# Altium project BLE-Control.PrjPcb
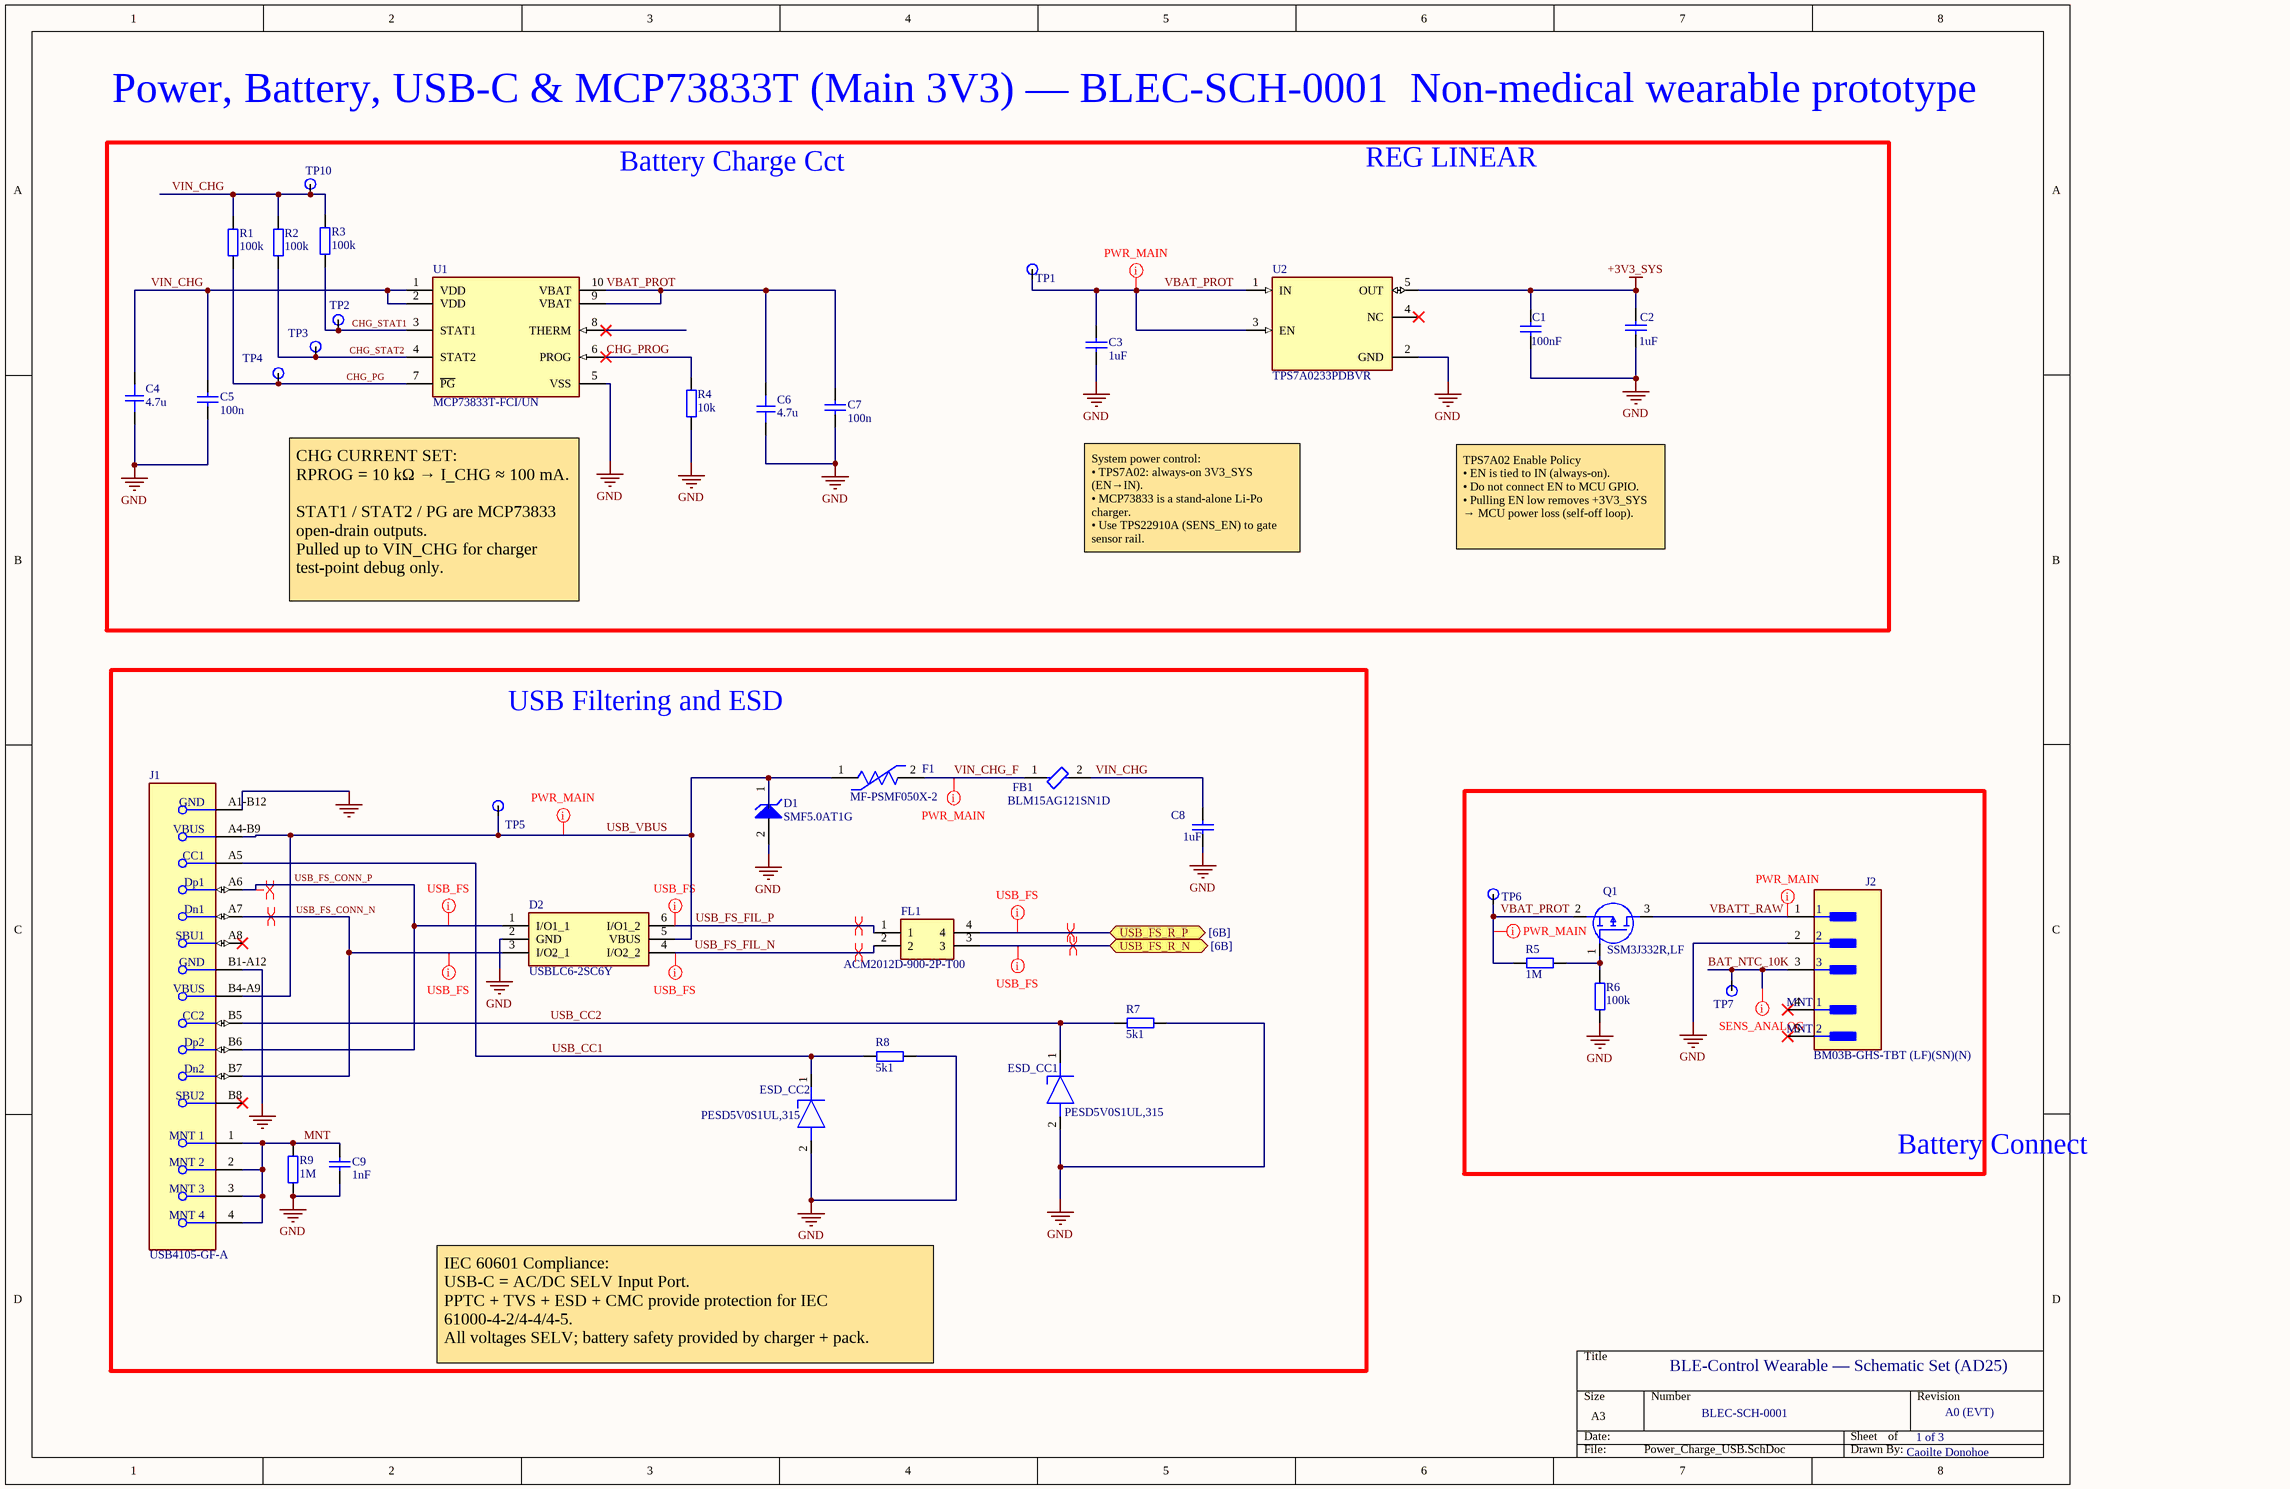
[diagram p0: Power_Charge_USB.SchDoc]
3 sheets, 107 parts. Net scope: flat (ports and power ports of the same name join across sheets).
Board file: BLE-Control.PcbDoc
Sheets:
  Power_Charge_USB.SchDoc
  MCU_RF.SchDoc
  Sensor_IO_Buttons_LED.SchDoc

## Sheet Power_Charge_USB.SchDoc
size A3; SheetNumber: 1; SheetTotal: 3

### Parts
C1  100nF  [CAP_0402]
C2  1uF  [CAP_0402]
C3  1uF  [CAP_0402]
C4  4.7u  [CAP_0603]
C5  100n  [CAP_0402]
C6  4.7u  [CAP_0603]
C7  100n  [CAP_0402]
C8  1uF  [CAP_0402]
C9  1nF  [CAP_0402]
D1  SMF5.0AT1G  [ONSC-SOD-123FL-2-498_V]
D2  USBLC6-2SC6Y  [SOT95P280X145-6N]
ESD_CC1  PESD5V0S1UL,315  [PESD5V0S1BL315]
ESD_CC2  PESD5V0S1UL,315  [PESD5V0S1BL315]
F1  MF-PSMF050X-2  [FP-MF-PSMF-MFG]
FB1  BLM15AG121SN1D  [FP-BLM15-0_05-IPC_A]
FL1  ACM2012D-900-2P-T00  [ACM2012D9002PT00]
J1  USB4105-GF-A  [FP-USB4105-GF-A-MFG]
J2  BM03B-GHS-TBT (LF)(SN)(N)  [FP-BM03B-GHS-TBT_LF_SN-MFG]
Q1  SSM3J332R,LF  [SSM3J332RLFT]
R1  100k  [RES_0603]
R2  100k  [RES_0603]
R3  100k  [RES_0603]
R4  10k  [RES_0402]
R5  1M  [RES_0402]
R6  100k  [RES_0402]
R7  5k1  [RES_0402]
R8  5k1  [RES_0402]
R9  1M  [RES_0402]
TP1  TestPoint  [PCBComponent_1]  (value not drawn)
TP2  USB_VBUS  [PCBComponent_1]  (value not drawn)
TP3  USB_VBUS  [PCBComponent_1]  (value not drawn)
TP4  USB_VBUS  [PCBComponent_1]  (value not drawn)
TP5  USB_VBUS  [PCBComponent_1]  (value not drawn)
TP6  VBAT_PROT  [PCBComponent_1]  (value not drawn)
TP7  BAT_NTC_10K  [PCBComponent_1]  (value not drawn)
TP10  (no value)  [TP_VIA_0p75]
U1  MCP73833T-FCI/UN  [FP-C04-021-IPC_B]
U2  TPS7A0233PDBVR  [FP-DBV0005A-IPC_A]

### Blocks framed on the sheet
USB Filtering and ESD: C8 C9 D1 D2 ESD_CC1 ESD_CC2 F1 FB1 FL1 J1 R7-R9 TP5
Battery Connect: J2 Q1 R5 R6 TP6 TP7

### Ports
USB_FS_R_N (bidir, see [6B]), USB_FS_R_P (bidir, see [6B])

### Nets
+3V3_SYS: C1.2 C2.2 U2.5(OUT)
GND: C1.1 C2.1 C3.1 C4.1 C5.1 C6.1 C7.1 C8.1 C9.1 D1.2(A) D2.2(GND) ESD_CC1.2(A) ESD_CC2.2(A) J1.A1-B12(GND) J1.B1-A12(GND) J2.2 R4.1 R6.1 R7.2 R8.2 R9.1 U1.5(VSS) U2.2(GND)
BAT_NTC_10K: J2.3 TP7.1
CHG_PG: R1.1 TP4.1 U1.7(~{PG})
CHG_PROG: R4.2 U1.6(PROG)
CHG_STAT1: R3.1 TP2.1 U1.3(STAT1)
CHG_STAT2: R2.1 TP3.1 U1.4(STAT2)
MNT: C9.2 J1.1(MNT_1) J1.2(MNT_2) J1.3(MNT_3) J1.4(MNT_4) R9.2
USB_CC1: ESD_CC2.1(K) J1.A5(CC1) R8.1
USB_CC2: ESD_CC1.1(K) J1.B5(CC2) R7.1
USB_FS_CONN_N: D2.3(I/O2_1) J1.A7(Dn1) J1.B7(Dn2)
USB_FS_CONN_P: D2.1(I/O1_1) J1.A6(Dp1) J1.B6(Dp2)
USB_FS_FIL_N: D2.4(I/O2_2) FL1.2
USB_FS_FIL_P: D2.6(I/O1_2) FL1.1
USB_FS_R_N: FL1.3 ; port USB_FS_R_N
USB_FS_R_P: FL1.4 ; port USB_FS_R_P
USB_VBUS: D1.1(K) D2.5(VBUS) F1.1 J1.A4-B9(VBUS) J1.B4-A9(VBUS) TP5.1
VBAT_PROT: C3.2 C6.2 C7.2 Q1.2(S) R5.1 TP1.1 TP6.1 U1.9(VBAT) U1.10(VBAT) U2.1(IN) U2.3(EN)
VBATT_RAW: J2.1 Q1.3(D)
VIN_CHG: C4.2 C5.2 C8.2 FB1.2 R1.2 R2.2 R3.2 TP10.1 U1.1(VDD) U1.2(VDD)
VIN_CHG_F: F1.2 FB1.1
NetQ1_1: Q1.1(G) R5.2 R6.2

Not connected (* = marked no-connect by the designer): J1 A8(SBU1)* B8(SBU2)*; J2 4(MNT_1)* 5(MNT_2)*; U1 8(THERM)*; U2 4(NC)*

### Layout directives
differential pair; differential pair class USB: USB_FS_CONN_N, USB_FS_CONN_P, USB_FS_FIL_N, USB_FS_FIL_P, USB_FS_R_N, USB_FS_R_P
net class USB_FS: USB_FS_CONN_N, USB_FS_CONN_P, USB_FS_FIL_N, USB_FS_FIL_P, USB_FS_R_N, USB_FS_R_P
net class PWR_MAIN: USB_VBUS, VBAT_PROT, VBATT_RAW, VIN_CHG_F
net class SENS_ANALOG: BAT_NTC_10K

### Notes on the sheet
- Power, Battery, USB-C & MCP73833T (Main 3V3) — BLEC-SCH-0001  Non-medical wearable prototype
- Battery Charge Cct
- REG LINEAR
- System power control:
  • TPS7A02: always-on 3V3_SYS (EN→IN).
  • MCP73833 is a stand-alone Li-Po charger.
  • Use TPS22910A (SENS_EN) to gate sensor rail.
- TPS7A02 Enable Policy
  • EN is tied to IN (always-on).
  • Do not connect EN to MCU GPIO.
  • Pulling EN low removes +3V3_SYS → MCU power loss (self-off loop).
- CHG CURRENT SET:
  RPROG = 10 kΩ → I_CHG ≈ 100 mA.
  STAT1 / STAT2 / PG are MCP73833 open-drain outputs.
  Pulled up to VIN_CHG for charger test-point debug only.
- IEC 60601 Compliance:
  USB-C = AC/DC SELV Input Port.
  PPTC + TVS + ESD + CMC provide protection for IEC 61000-4-2/4-4/4-5.
  All voltages SELV; battery safety provided by charger + pack.
- BLE-Control Wearable — Schematic Set (AD25)
- BLEC-SCH-0001
- 1 of 3
- A0 (EVT)
- Caoilte Donohoe

### Library data of the parts
C1-C3 C5 C7 = C_0402: Ceramic Chip Capacitor 0402; Voltage: 10V; Dielectric: X7R; Tolerance: 10%; ProductionStatus: Placeholder; Package: 0402 (1005); Height: 0.35mm
C4 C6 = CAP_0603: Capacitor SMD 0603; Manufacturer: *; Manufacturer Part Number: *; Distributor Link: *; LCSC: *; Rating: *; Dielectric: *
C8 C9 = C_0402: Ceramic Chip Capacitor 0402; PartNumber: C1005X5R1E105K; Voltage: 10V; Dielectric: X7R; Tolerance: 10%; ProductionStatus: Placeholder; Package: 0402 (1005); Height: 0.35mm; Part Number: C1005X5R1E105K
D1 = CMP-1061-00612-1: 200 W Transient Voltage Suppressor, 2-Pin SOD-123FL, Pb-Free, Tape and Reel; Manufacturer: On Semiconductor; Direction: Unidirectional; IR Max (uA): 400; V(BR) Typ (V): 6.7; PackageDescription: 2-Pin SOD, Body 1.65 x 2.7 mm; PartNumber: SMF5.0AT1G; ComponentLink3Description: Package Specification; ComponentLink3URL: http://www.onsemi.com/pub_link/Collateral/498-01.PDF; PackageVersion: Rev. D, 05/2013; Mounting Technology: Surface Mount; PackageReference: SOD-123FL-2-498; ComponentLink2URL: http://www.onsemi.com/pub_link/Collateral/SMF5.0AT1-D.PDF; DatasheetVersion: Rev. 7; ComponentLink1Description: Manufacturer URL; Packing: Tape and Reel; RoHS: Pb-Free; ComponentLink1URL: http://www.onsemi.com/; ComponentLink2Description: Datasheet
D2 = USBLC6-2SC6Y: Diode; Manufacturer_Name: STMicroelectronics; Datasheet Link: https://componentsearchengine.com/Datasheets/1/USBLC6-2SC6Y.pdf; Height: 1.45mm; Manufacturer_Part_Number: USBLC6-2SC6Y; Mouser Part Number: 511-USBLC6-2SC6Y; Mouser Price/Stock: https://www.mouser.co.uk/ProductDetail/STMicroelectronics/USBLC6-2SC6Y?qs=gNDSiZmRJS%2FOgDexvXkdow%3D%3D; Arrow Part Number: USBLC6-2SC6Y; Arrow Price/Stock: https://www.arrow.com/en/products/usblc6-2sc6y/stmicroelectronics?utm_currency=USD&region=nac
ESD_CC1 ESD_CC2 = PESD5V0S1UL,315: Diode ESD (Uni-directional); Manufacturer_Name: Nexperia; Datasheet Link: https://assets.nexperia.com/documents/data-sheet/PESD5V0S1UL.pdf; Height: 0mm; Manufacturer_Part_Number: PESD5V0S1UL,315; Mouser Part Number: 771-PESD5V0S1UL315; Mouser Price/Stock: https://www.mouser.co.uk/ProductDetail/Nexperia/PESD5V0S1UL315?qs=LOCUfHb8d9sSC%2FUB7ugsVw%3D%3D; Arrow Part Number: PESD5V0S1UL,315; Arrow Price/Stock: https://www.arrow.com/en/products/pesd5v0s1ul315/nexperia?utm_currency=USD&region=nac
F1 = CMP-07400-000013-1: PTC RESET FUSE 6V 500MA 0805; Manufacturer: Bourns Inc.; Trip Current: 1A; Trip Time: 0.1s; Value: 0.15-0.9Ω; Hold Current: 0.5A; Current Rating: 40A; Category: Fuse; Temperature: -40°C to +85°C; ComponentLink2Description: Datasheet; Manufacturer Part Number: MF-PSMF050X-2; Temperature Range High: +85°C; Package: MF-PSMF; Device Class L1: Circuit Protection; Lead Free: Yes; ComponentLink2URL: https://www.bourns.com/docs/product-datasheets/mfpsmf.pdf?sfvrsn=9c05cafe_24; Ambient Temperature Range Low: -40°C; Mouser Description: Resettable Fuses - PPTC .50A 6V 0.15ohm Hold .5 Trip 1; Resistance: 0.15-0.9Ω; Automotive: Yes; Ambient Temperature Range High: +85°C; Device Class L2: PTC Resettable Fuses; Temperature Range Low: -40°C; Device Class L3: unset; Octopart: https://octopart.com/mf-psmf050x-2-bourns-7483438; Digikey Description: PTC RESET FUSE 6V 500MA 0805; Height: 0.85mm; RoHS: TRUE; Voltage Rating: 6V
FB1 = CMP-0686-00170-4: Chip Ferrite Bead, 0402, 120Ω @ 100MHz, 0.19Ω, 25%, 550mA; Material: Steel; Max DC Current: 500mA; Shielding: Unshielded; Number of Lines: 1; DC Resistance (DCR): 190mR; Impedance: 120R; Packaging: Tape and Reel; Core Material: Ferrite; Number of Pins: 2; Tolerance: 25%; Case Code (Imperial): 0402; DC Current: 500mA; Termination: SMD/SMT; Height: 0.5mm; REACH SVHC: No SVHC; Max Operating Temperature: 125°C; Case Code (Metric): 1005; Length: 1mm; Test Frequency: 100MHz; Lead Free: Lead Free; Depth: 0.55mm; Max Current Rating: 550mA; Case/Package: 0402; Min Operating Temperature: -55°C; Width: 0.5mm; Military Standard: Not; Frequency: 100MHz; Current Rating: 550mA; Package Quantity: 1; Number of Circuits: 1; Radiation Hardening: No
FL1 = ACM2012D-900-2P-T00: Filter; Manufacturer_Name: TDK; Datasheet Link: https://product.tdk.com/en/search/emc/emc/cmf_cmc/info/print_pdf; Height: 1.3mm; Manufacturer_Part_Number: ACM2012D-900-2P-T00; Mouser Part Number: 810-ACM2012D9002PT00; Mouser Price/Stock: https://www.mouser.co.uk/ProductDetail/TDK/ACM2012D-900-2P-T00?qs=uxmvvYJjMIufvI0tFhRfZA%3D%3D; Arrow Part Number: ACM2012D-900-2P-T00; Arrow Price/Stock: https://www.arrow.com/en/products/acm2012d-900-2p-t00/tdk?utm_currency=USD&region=nac
J1 = CMP-245163-000001-1: CONN RCPT USB2.0 TYPEC 5A; Manufacturer: GCT; Voltage Rating: 20V; Is Female: yes; Current Rating: 5/6.25/1.25/0.25A; Number Of Contacts: 16; Conn Orientation: Right Angle; Device Class L1: Connectors; Category: Conn; Lead Free: Yes; RoHS: TRUE; Temperature Range High: +85°C; Digikey Description: CONN RCPT USB2.0 TYPEC 5A; Device Class L3: unset; ComponentLink2Description: Datasheet; Manufacturer Part Number: USB4105-GF-A; Package: 0; Usb Standard: USB 2.0; Device Class L2: USB Connectors; Automotive: No; Temperature Range Low: -40°C; Height: 3.46mm; Temperature: -40°C to +85°C; Contact Material: Gold,Nickel; ComponentLink2URL: https://gct.co/files/drawings/usb4105.pdf; Octopart: https://octopart.com/usb4105-gf-a-gct-106627878
J2 = CMP-17439-000616-1: CONN HEADER SMD 3POS 1.25MM; Mated Stacking Heights: 7.3mm; Voltage Rating: 50V; Pitch: 0.049inch; Number of Positions: 3; Contact Material: Bronze; Number of Rows: 1; Packaging: Cut Tape; Fastening Type: Ramp; Contact Shape: Rectangular; Termination: Solder; Flammability Rating: UL94 V-0; Lead Free: Lead Free; Color: Natural; Mount: Surface Mount; Contact Finish - Mating: TIN; Max Operating Temperature: 85°C; Series: GH; Insulation Color: Natural; Connector Type: Header; Insulation Material: Nylon; Contact Type: Outer Shroud Contact; Min Operating Temperature: -25°C; Contact Plating: Tin
Q1 = SSM3J332R,LF: MOSFET (P-Channel); Manufacturer_Name: Toshiba; Datasheet Link: https://www.mouser.com/datasheet/2/408/SSM3J332R_datasheet_en_20181015-1150575.pdf; Manufacturer_Part_Number: SSM3J332R,LF; Mouser Part Number: 757-SSM3J332RLF; Mouser Price/Stock: https://www.mouser.co.uk/ProductDetail/Toshiba/SSM3J332RLF?qs=%252B8yZ8wZTKG5UW86maIHWeg%3D%3D; Arrow Part Number: SSM3J332R,LF; Arrow Price/Stock: https://www.arrow.com/en/products/ssm3j332rlf/toshiba?region=nac
R1-R3 = RES_0603: Resistor SMD 0603; Manufacturer: *; Manufacturer Part Number: *; Distributor Link: *; LCSC: *
R4-R9 = R_0402: Resistor SMD 0402; Manufacturer: *; Manufacturer Part Number: *; Distributor Link: *; LCSC: *
TP2-TP7 TP10 = TestPoint
U1 = MCP73833T-FCI-UN: IC LI-ION/LI-POLY CTRLR 10MSOP; Output Voltage: 4.5V; Min Supply Voltage: 3.75V; Output Current: 1.2A; Number of Cells: 1; Max Charge Current: 1.1A; Battery Pack Voltage: 4.2V; Max Supply Voltage: 6V; Fault Protection: Over Temperature; Mount: Surface Mount; Number of Pins: 10; Lead Free: Lead Free; Min Operating Temperature: -40°C; Radiation Hardening: No; Case/Package: MSOP; Max Operating Temperature: 85°C; Packaging: Tape and Reel; Package Quantity: 2500
U2 = CMP-04917-000286-1: IC REG LINEAR 3.3V 200MA SOT23-5; RoHS Compliant: Yes

## Sheet MCU_RF.SchDoc
size A3; SheetNumber: 2; SheetTotal: 3
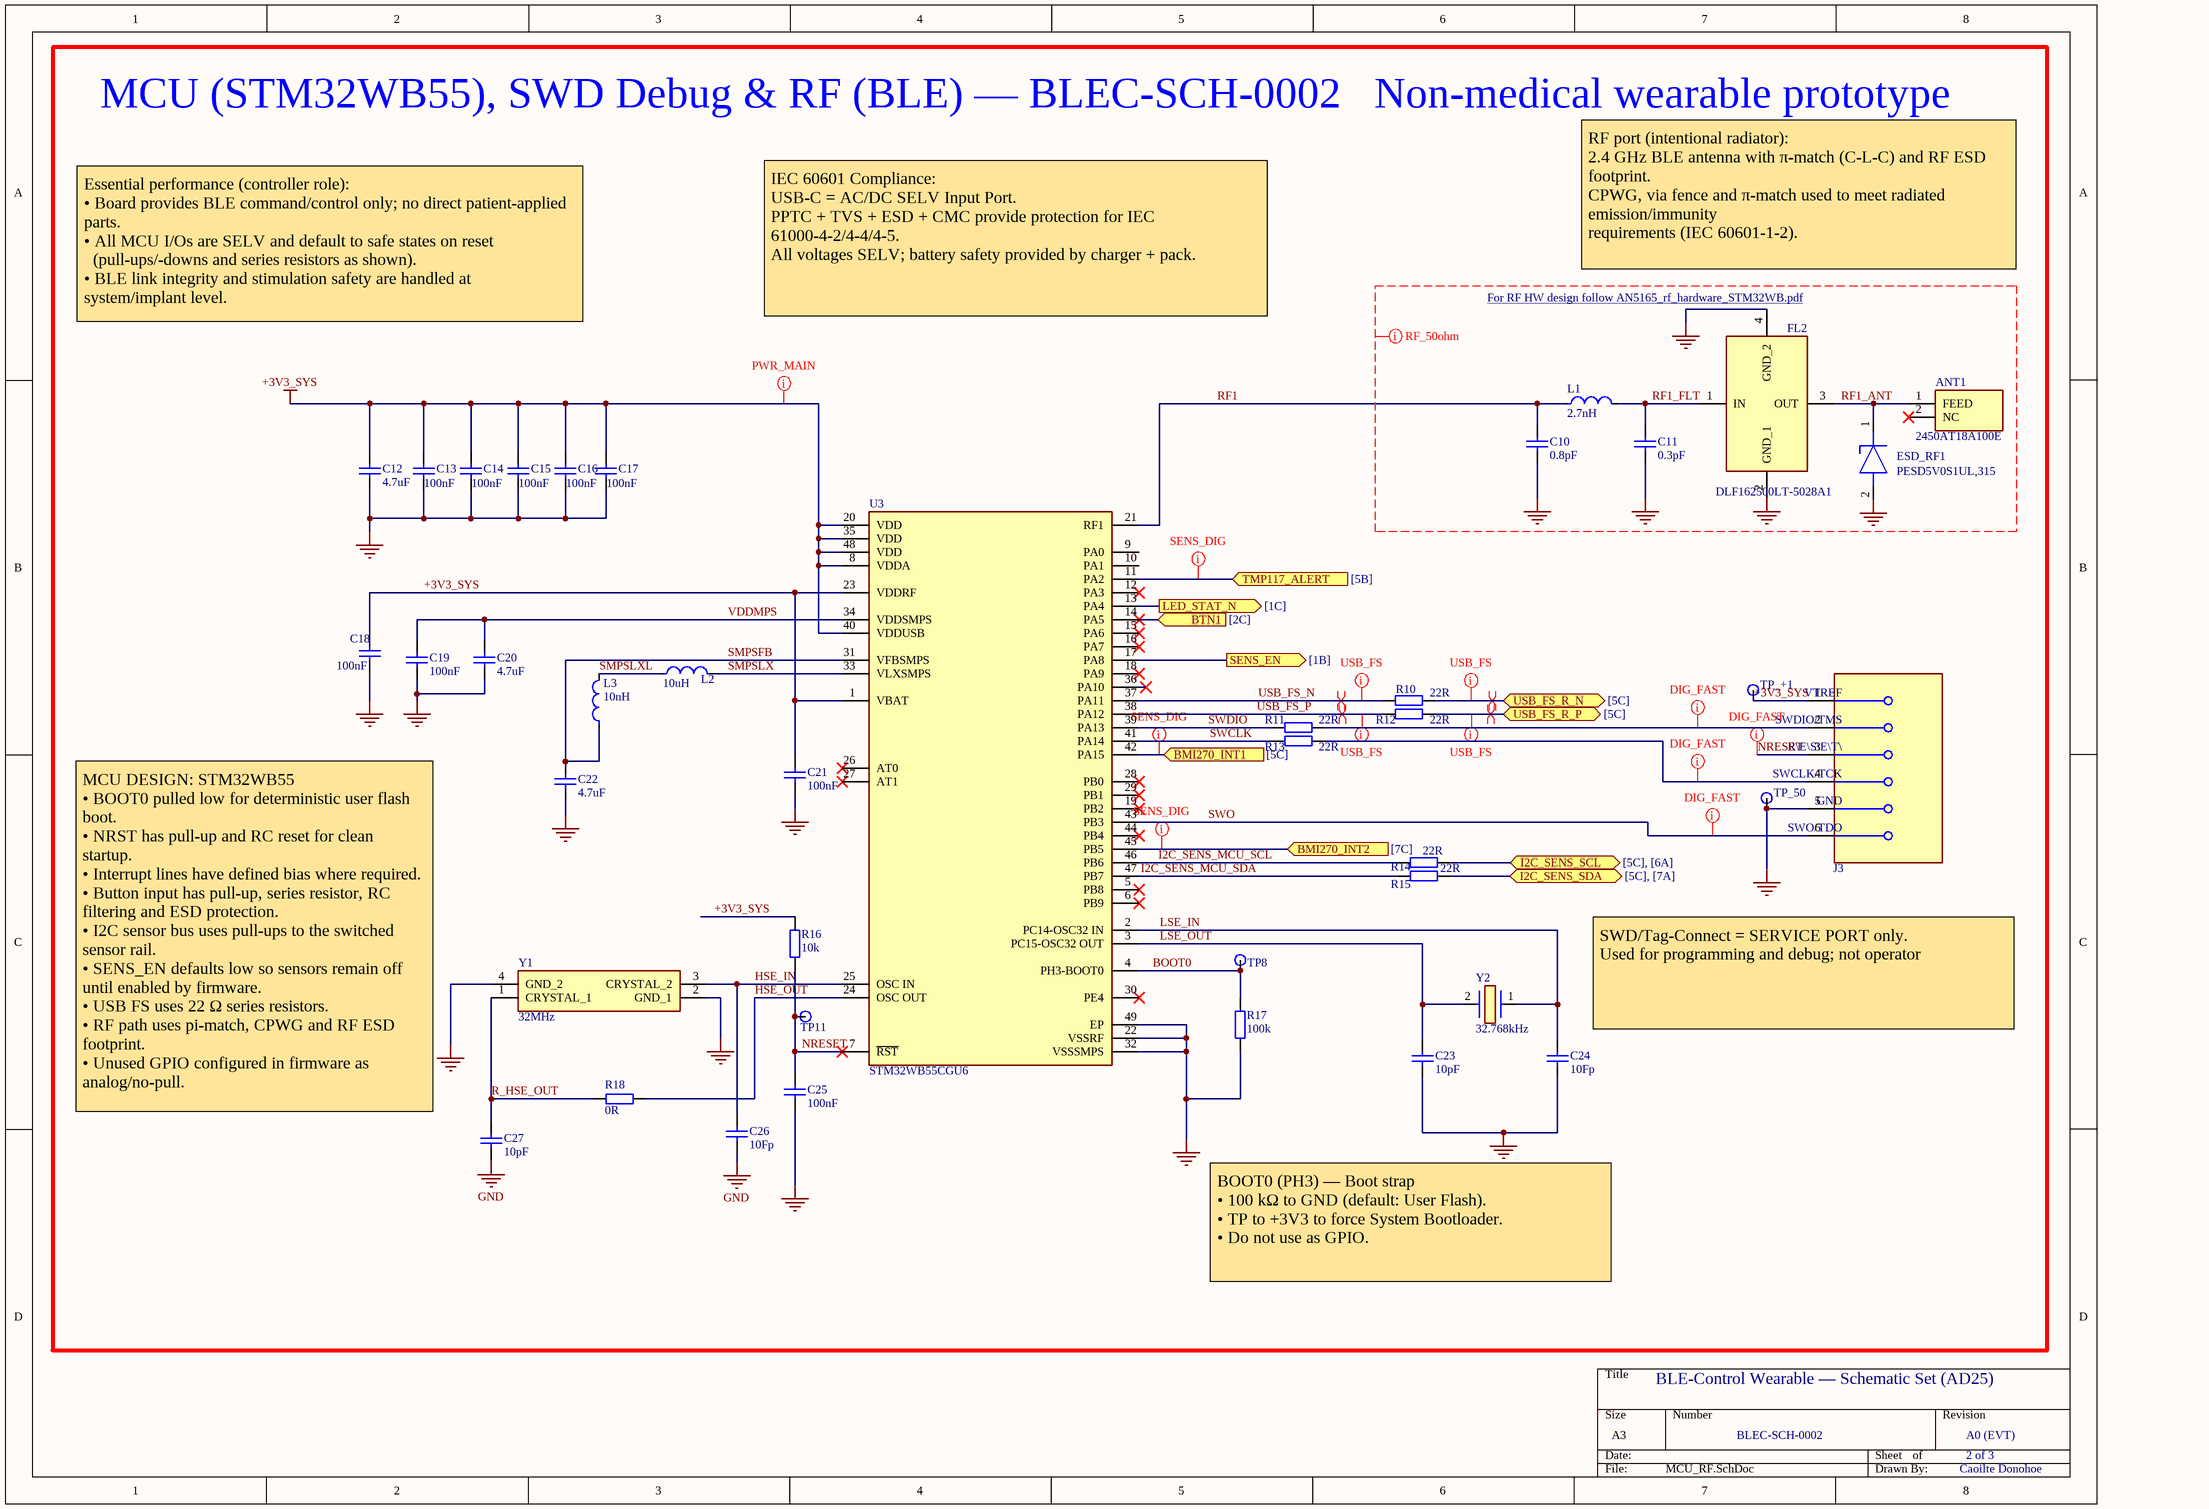
[diagram p1: MCU_RF.SchDoc]

### Parts
ANT1  2450AT18A100E  [ANTC3216X140N]
C10  0.8pF  [CAP_0402]
C11  0.3pF  [CAP_0402]
C12  4.7uF  [CAP_0402]
C13  100nF  [CAP_0402]
C14  100nF  [CAP_0402]
C15  100nF  [CAP_0402]
C16  100nF  [CAP_0402]
C17  100nF  [CAP_0402]
C18  100nF  [CAP_0402]
C19  100nF  [CAP_0402]
C20  4.7uF  [CAP_0402]
C21  100nF  [CAP_0402]
C22  4.7uF  [CAP_0402]
C23  10pF  [CAP_0402]
C24  10Fp  [CAP_0402]
C25  100nF  [CAP_0402]
C26  10Fp  [CAP_0402]
C27  10pF  [CAP_0402]
ESD_RF1  PESD5V0S1UL,315  [PESD5V0S1BL315]
FL2  DLF162500LT-5028A1  [DLF162500LT5028A1 - duplicate]
J3  TC2030-CTX-NL  [Tag_Connect_0_MFG]  (value not drawn)
L1  2.7nH  [FP-LQW15AN_00-W0_6-0_1-MFG]
L2  10uH  [FP-LQM21FN_70-IPC_B]
L3  10nH  [FP-LQW15AN_00-W0_6-0_1-MFG]
R10  22R  [RES_0402]
R11  22R  [RES_0402]
R12  22R  [RES_0402]
R13  22R  [RES_0402]
R14  22R  [RES_0402]
R15  22R  [RES_0402]
R16  10k  [RES_0402]
R17  100k  [RES_0402]
R18  0R  [RES_0402]
TP8  TestPoint  [PCBComponent_1]  (value not drawn)
TP11  TestPoint  [PCBComponent_1]  (value not drawn)
TP_50  TestPoint  [TP_VIA_0p75]  (value not drawn)
TP_+1  TP_+3V3_SYS  [TP_VIA_0p75]  (value not drawn)
U3  STM32WB55CGU6  [FP-STM32WB55CGU6-IPC_C]
Y1  32MHz  [NX3225SA32MHZEXS00ACS02368]
Y2  32.768kHz  [ABS07]

### Ports
BMI270_INT1 (in, see [5C]), BMI270_INT2 (in, see [7C]), BTN1 (in, see [2C]), I2C_SENS_SCL (bidir, see [5C], [6A]), I2C_SENS_SDA (bidir, see [5C], [7A]), LED_STAT_N (out, see [1C]), SENS_EN (out, see [1B]), TMP117_ALERT (in, see [5B]), USB_FS_R_N (bidir, see [5C]), USB_FS_R_P (bidir, see [5C])

### Nets
+3V3_SYS: C12.2 C13.2 C14.2 C15.2 C16.2 C17.2 C18.2 C21.2 J3.1(VTREF) R16.2 TP_+1.1 U3.1(VBAT) U3.8(VDDA) U3.20(VDD) U3.23(VDDRF) U3.35(VDD) U3.40(VDDUSB) U3.48(VDD)
GND: C10.1 C11.1 C12.1 C13.1 C14.1 C15.1 C16.1 C17.1 C18.1 C19.1 C20.1 C21.1 C22.1 C23.1 C24.1 C25.1 C26.1 C27.1 ESD_RF1.2(A) FL2.2(GND_1) FL2.4(GND_2) J3.5(GND) R17.1 TP_50.1 U3.22(VSSRF) U3.32(VSSSMPS) U3.49(EP) Y1.2(GND_1) Y1.4(GND_2)
BMI270_INT1: U3.42(PA15) ; port BMI270_INT1
BMI270_INT2: U3.45(PB5) ; port BMI270_INT2
BOOT0: R17.2 TP8.1 U3.4(PH3-BOOT0)
BTN1: U3.14(PA5) ; port BTN1
HSE_IN: C26.2 U3.25(OSC_IN) Y1.3(CRYSTAL_2)
HSE_OUT: R18.2 U3.24(OSC_OUT)
I2C_SENS_MCU_SCL: R14.1 U3.46(PB6)
I2C_SENS_MCU_SDA: R15.1 U3.47(PB7)
I2C_SENS_SCL: R14.2 ; port I2C_SENS_SCL
I2C_SENS_SDA: R15.2 ; port I2C_SENS_SDA
LED_STAT_N: U3.13(PA4) ; port LED_STAT_N
LSE_IN: C24.2 U3.2(PC14-OSC32_IN) Y2.1
LSE_OUT: C23.2 U3.3(PC15-OSC32_OUT) Y2.2
NRESET: C25.2 J3.3(~{RESET}) R16.1 TP11.1 U3.7(~{RST})
R_HSE_OUT: C27.2 R18.1 Y1.1(CRYSTAL_1)
RF1: C10.2 L1.1 U3.21(RF1)
RF1_ANT: ANT1.1(FEED) ESD_RF1.1(K) FL2.3(OUT)
RF1_FLT: C11.2 FL2.1(IN) L1.2
SENS_EN: U3.17(PA8) ; port SENS_EN
SMPSFB: C22.2 L3.1 U3.31(VFBSMPS)
SMPSLX: L2.2 U3.33(VLXSMPS)
SMPSLXL: L2.1 L3.2
SWCLK: R13.1 U3.41(PA14)
SWDIO: R11.1 U3.39(PA13)
SWO: J3.6(SWO/TDO) U3.43(PB3)
TMP117_ALERT: U3.11(PA2) ; port TMP117_ALERT
USB_FS_N: R10.1 U3.37(PA11)
USB_FS_P: R12.1 U3.38(PA12)
USB_FS_R_N: R10.2 ; port USB_FS_R_N
USB_FS_R_P: R12.2 ; port USB_FS_R_P
VDDMPS: C19.2 C20.2 U3.34(VDDSMPS)
NetJ3_2: J3.2(SWDIO/TMS) R11.2
NetJ3_4: J3.4(SWCLK/TCK) R13.2

Not connected (* = marked no-connect by the designer): ANT1 2(NC)*; U3 5(PB8)* 6(PB9)* 9(PA0) 10(PA1) 12(PA3)* 15(PA6)* 16(PA7)* 18(PA9)* 19(PB2)* 26(AT0)* 27(AT1)* 28(PB0)* 29(PB1)* 30(PE4)* 36(PA10)* 44(PB4)*

### Layout directives
differential pair; differential pair class USB: USB_FS_N, USB_FS_P, USB_FS_R_N, USB_FS_R_P
net class RF_50ohm: GND, RF1_ANT, RF1_FLT
net class PWR_MAIN: +3V3_SYS
net class USB_FS: USB_FS_N, USB_FS_P, USB_FS_R_N, USB_FS_R_P
net class DIG_FAST: NetJ3_2, NetJ3_4, NRESET, SWO
net class I2C: BMI270_INT1, BMI270_INT2, TMP117_ALERT

### Notes on the sheet
- MCU (STM32WB55), SWD Debug & RF (BLE) — BLEC-SCH-0002   Non-medical wearable prototype
- Essential performance (controller role):
  • Board provides BLE command/control only; no direct patient-applied parts.
  • All MCU I/Os are SELV and default to safe states on reset
  (pull-ups/-downs and series resistors as shown).
  • BLE link integrity and stimulation safety are handled at system/implant level.
- IEC 60601 Compliance:
  USB-C = AC/DC SELV Input Port.
  PPTC + TVS + ESD + CMC provide protection for IEC 61000-4-2/4-4/4-5.
  All voltages SELV; battery safety provided by charger + pack.
- (near FL2) For RF HW design follow AN5165_rf_hardware_STM32WB.pdf <https://www.st.com/resource/en/application_note/an5165-how-to-develop-rf-hardware-using-stm32wb-microcontrollers-stmicroelectronics.pdf>
- RF port (intentional radiator):
  2.4 GHz BLE antenna with π-match (C-L-C) and RF ESD footprint.
  CPWG, via fence and π-match used to meet radiated emission/immunity
  requirements (IEC 60601-1-2).
- (near C24) SWD/Tag-Connect = SERVICE PORT only.
  Used for programming and debug; not operator
- MCU DESIGN: STM32WB55
  • BOOT0 pulled low for deterministic user flash boot.
  • NRST has pull-up and RC reset for clean startup.
  • Interrupt lines have defined bias where required.
  • Button input has pull-up, series resistor, RC filtering and ESD protection.
  • I2C sensor bus uses pull-ups to the switched sensor rail.
  • SENS_EN defaults low so sensors remain off until enabled by firmware.
  • USB FS uses 22 Ω series resistors.
  • RF path uses pi-match, CPWG and RF ESD footprint.
  • Unused GPIO configured in firmware as analog/no-pull.
- BOOT0 (PH3) — Boot strap
  • 100 kΩ to GND (default: User Flash).
  • TP to +3V3 to force System Bootloader.
  • Do not use as GPIO.
- BLE-Control Wearable — Schematic Set (AD25)
- BLEC-SCH-0002
- A0 (EVT)
- 2 of 3
- Caoilte Donohoe

### Library data of the parts
ANT1 = 2450AT18A100E: Antenna; Manufacturer_Name: JOHANSON TECHNOLOGY; Datasheet Link: https://www.johansontechnology.com/datasheets/2450AT18A100/2450AT18A100.pdf; Height: 1.4mm; Manufacturer_Part_Number: 2450AT18A100E; Mouser Part Number: 609-2450AT18A100E; Mouser Price/Stock: https://www.mouser.co.uk/ProductDetail/Johanson-Technology/2450AT18A100E?qs=yCnrNFeXz%252BjzOYKPg7LGCw%3D%3D; Arrow Part Number: 2450AT18A100E; Arrow Price/Stock: https://www.arrow.com/en/products/2450at18a100e/johanson-dielectrics?utm_currency=USD&region=europe
C10 = C_0402: GRM1555C1HR80BA01D; Voltage: 10V; Dielectric: X7R; Tolerance: 10%; ProductionStatus: Placeholder; Package: 0402 (1005); Height: 0.35mm
C11 = C_0402: GRM1555C1HR30WA01D; Voltage: 10V; Dielectric: X7R; Tolerance: 10%; ProductionStatus: Placeholder; Package: 0402 (1005); Height: 0.35mm
C12 C20 C22 = C_0402: as C8 on sheet Power_Charge_USB; Package: 0402 (1005); Height: 0.35mm; Part Number: C1005X5R1E105K
C13-C19 C21 C23-C27 = C_0402: as C1 on sheet Power_Charge_USB; Package: 0402 (1005); Height: 0.35mm
ESD_RF1 = PESD5V0S1UL,315: as ESD_CC1 on sheet Power_Charge_USB; Datasheet Link: https://assets.nexperia.com/documents/data-sheet/PESD5V0S1UL.pdf; Height: 0mm; Manufacturer_Part_Number: PESD5V0S1UL,315; Mouser Part Number: 771-PESD5V0S1UL315; Mouser Price/Stock: https://www.mouser.co.uk/ProductDetail/Nexperia/PESD5V0S1UL315?qs=LOCUfHb8d9sSC%2FUB7ugsVw%3D%3D; Arrow Part Number: PESD5V0S1UL,315; Arrow Price/Stock: https://www.arrow.com/en/products/pesd5v0s1ul315/nexperia?utm_currency=USD&region=nac
FL2 = DLF162500LT-5028A1: Filter; Manufacturer_Name: TDK; Datasheet Link: https://product.tdk.com/system/files/dam/doc/product/rf/rf/filter/catalog/rf_lpf_dlf162500lt-5028a1_en.pdf; Height: 0.4mm; Manufacturer_Part_Number: DLF162500LT-5028A1; Mouser Part Number: 810-DLF16250LT5028A1; Mouser Price/Stock: https://www.mouser.co.uk/ProductDetail/TDK/DLF162500LT-5028A1?qs=U%2FZX79kHR%2FlwIbAISCs3qA%3D%3D; Arrow Part Number: DLF162500LT-5028A1; Arrow Price/Stock: https://www.arrow.com/en/products/dlf162500lt-5028a1/tdk?utm_currency=USD&region=nac
L1 = CMP-06042-002082-1: Wire Wound RF Inductor 10nH ±2% 500mA 0.17Ω 0402 (1005); Shielding: Unshielded; DC Resistance (DCR): 170mR; Test Frequency: 100MHz; Current: 370mA; Core Material: Non-Magnetic; Self Resonant Frequency: 5.5GHz; Tolerance: 2%; Depth: 0.7mm; Lead Free: Lead Free; Termination: SMD/SMT; Case Code (Imperial): 0402; Height - Seated (Max): 0.024inch; Package Quantity: 10000; Packaging: Tape and Reel; Case/Package: 0402; REACH SVHC: No SVHC; Length: 1mm; Weight: 2.8E-05oz; Resistor Type: Wirewound; Number of Pins: 2; Mount: Surface Mount; DC Current: 500mA; Max Operating Temperature: 125°C; Case Code (Metric): 1005; Width: 0.02inch; Max DC Current: 500mA; Inductance: 10nH; Radiation Hardening: No; Height: 0.5mm; Current Rating: 500mA; Min Operating Temperature: -55°C; Military Standard: Not; Inductance Tolerance: 2%
L2 = CMP-2000-06587-2: FIXED IND 10UH 100MA 780MOHM SMD; Shielding: Shielded; Core Material: Ferrite; Self Resonant Frequency: 15MHz; Tolerance: 20%; DC Resistance (DCR): 780mR; Test Frequency: 1MHz; Height: 1.45mm; Package Quantity: 3000; Width: 0.049inch; Inductance: 10uH; Saturation Current: 100mA; Termination: SMD/SMT; Case Code (Metric): 2012; Case/Package: 0805; RoHS Compliant: Yes; Series: LQM21F_70; Max Operating Temperature: 125°C; Lead Free: Lead Free; DC Current: 100mA; Length: 2.2mm; Radiation Hardening: No; Max DC Current: 100mA; Case Code (Imperial): 0805; Packaging: Tape and Reel; Height - Seated (Max): 0.057inch; Rated Current-Max: 100mA; Military Standard: Not; Mount: Surface Mount; Min Operating Temperature: -55°C; Depth: 1.45mm; Current Rating: 100mA
L3 = CMP-06042-002082-1: LQG15HS2N7S02; Shielding: Unshielded; Tolerance: 2%; DC Resistance (DCR): 170mR; Test Frequency: 100MHz; Current: 370mA; Core Material: Non-Magnetic; DC Current: 500mA; Self Resonant Frequency: 5.5GHz; Depth: 0.7mm; Lead Free: Lead Free; Termination: SMD/SMT; Case Code (Imperial): 0402; Height - Seated (Max): 0.024inch; Package Quantity: 10000; Packaging: Tape and Reel; Case/Package: 0402; REACH SVHC: No SVHC; Length: 1mm; Weight: 2.8E-05oz; Resistor Type: Wirewound; Number of Pins: 2; Mount: Surface Mount; Max Operating Temperature: 125°C; Case Code (Metric): 1005; Width: 0.02inch; Max DC Current: 500mA; Inductance: 10nH; Radiation Hardening: No; Height: 0.5mm; Current Rating: 500mA; Min Operating Temperature: -55°C; Military Standard: Not; Inductance Tolerance: 2%
R10-R18 = R_0402: Resistor SMD 0402; Manufacturer: *; Manufacturer Part Number: *; Distributor Link: *; LCSC: *
TP_+1 = TestPoint
U3 = CMP-12105-000013-1: ULTRA-LOW-POWER DUAL CORE ARM CO; Manufacturer: STMicroelectronics; Number Of Cores: 1; Number Of I2C Channels: 2; Interface: I2C,SPI,UART,USART,2-Wire,USB,IrDA,Other; Core Architecture: ARM Cortex-M4; Data Bus Width: 32bits; Memory Size: 1MBytes; Number Of Pwm Channels: 14; Max Supply Voltage: 3.6V; Standoff Height: 0mm; Number Of Timers/Counters: 6; Frequency: 64MHz; Max Junction Temp: +105°C; Number Of I/Os: 30; Min Supply Voltage: 1.71V; Number Of Adc Channels: 13; Ram Size: 256KBytes; Memory Type: FLASH; Octopart: https://octopart.com/stm32wb55cgu6-stmicroelectronics-98750847; Temperature Range High: +105°C; RoHS: TRUE; Number Of Spi Channels: 1; Category: IC; Device Class L1: Integrated Circuits (ICs); Lead Free: Yes; Height: 0.65mm; Number Of A/D Converters: 1; Package: UFQFPN48; Number Of Usb Channels: 1; Number Of Uart Channels: 2; Temperature Range Low: -40°C; Ambient Temperature Range Low: -40°C; Device Class L3: Microcontrollers; Manufacturer Part Number: STM32WB55CGU6; Temperature: -40°C to +105°C; ComponentLink2URL: https://www.st.com/resource/en/datasheet/stm32wb55cg.pdf; Device Class L2: Embedded Processors and Controllers; Digikey Description: ULTRA-LOW-POWER DUAL CORE ARM CO; ComponentLink2Description: Datasheet; Ambient Temperature Range High: +85°C; Automotive: No
Y1 = NX3225SA-32MHZ-EXS00A-CS02368: Crystal or Oscillator; Manufacturer_Name: NDK; Datasheet Link: https://hu.mouser.com/datasheet/2/905/ndk_04232018_NX3225SA-32MHZ-EXS00A-CS02368-1324924.pdf; Height: 0.6mm; Manufacturer_Part_Number: NX3225SA-32MHZ-EXS00A-CS02368; Mouser Part Number: 344-NX3225SA32MHZEXS; Mouser Price/Stock: https://www.mouser.co.uk/ProductDetail/NDK/NX3225SA-32MHZ-EXS00A-CS02368?qs=55YtniHzbhCu90OOsHDzwg%3D%3D
Y2 = ABS07-32.768KHZ-7-T: Crystal or Oscillator; Manufacturer_Name: ABRACON; Datasheet Link: https://abracon.com/Resonators/ABS07.pdf; Height: 0.9mm; Manufacturer_Part_Number: ABS07-32.768KHZ-7-T; Mouser Part Number: 815-ABS07-32.768K7T; Mouser Price/Stock: https://www.mouser.co.uk/ProductDetail/ABRACON/ABS07-32.768KHZ-7-T?qs=2nyfZ6BV3oibNEFok2qBLA%3D%3D; Arrow Part Number: ABS07-32.768KHZ-7-T; Arrow Price/Stock: https://www.arrow.com/en/products/abs07-32.768khz-7-t/abracon?utm_currency=USD&region=europe

## Sheet Sensor_IO_Buttons_LED.SchDoc
size A3; SheetNumber: 3; SheetTotal: 3
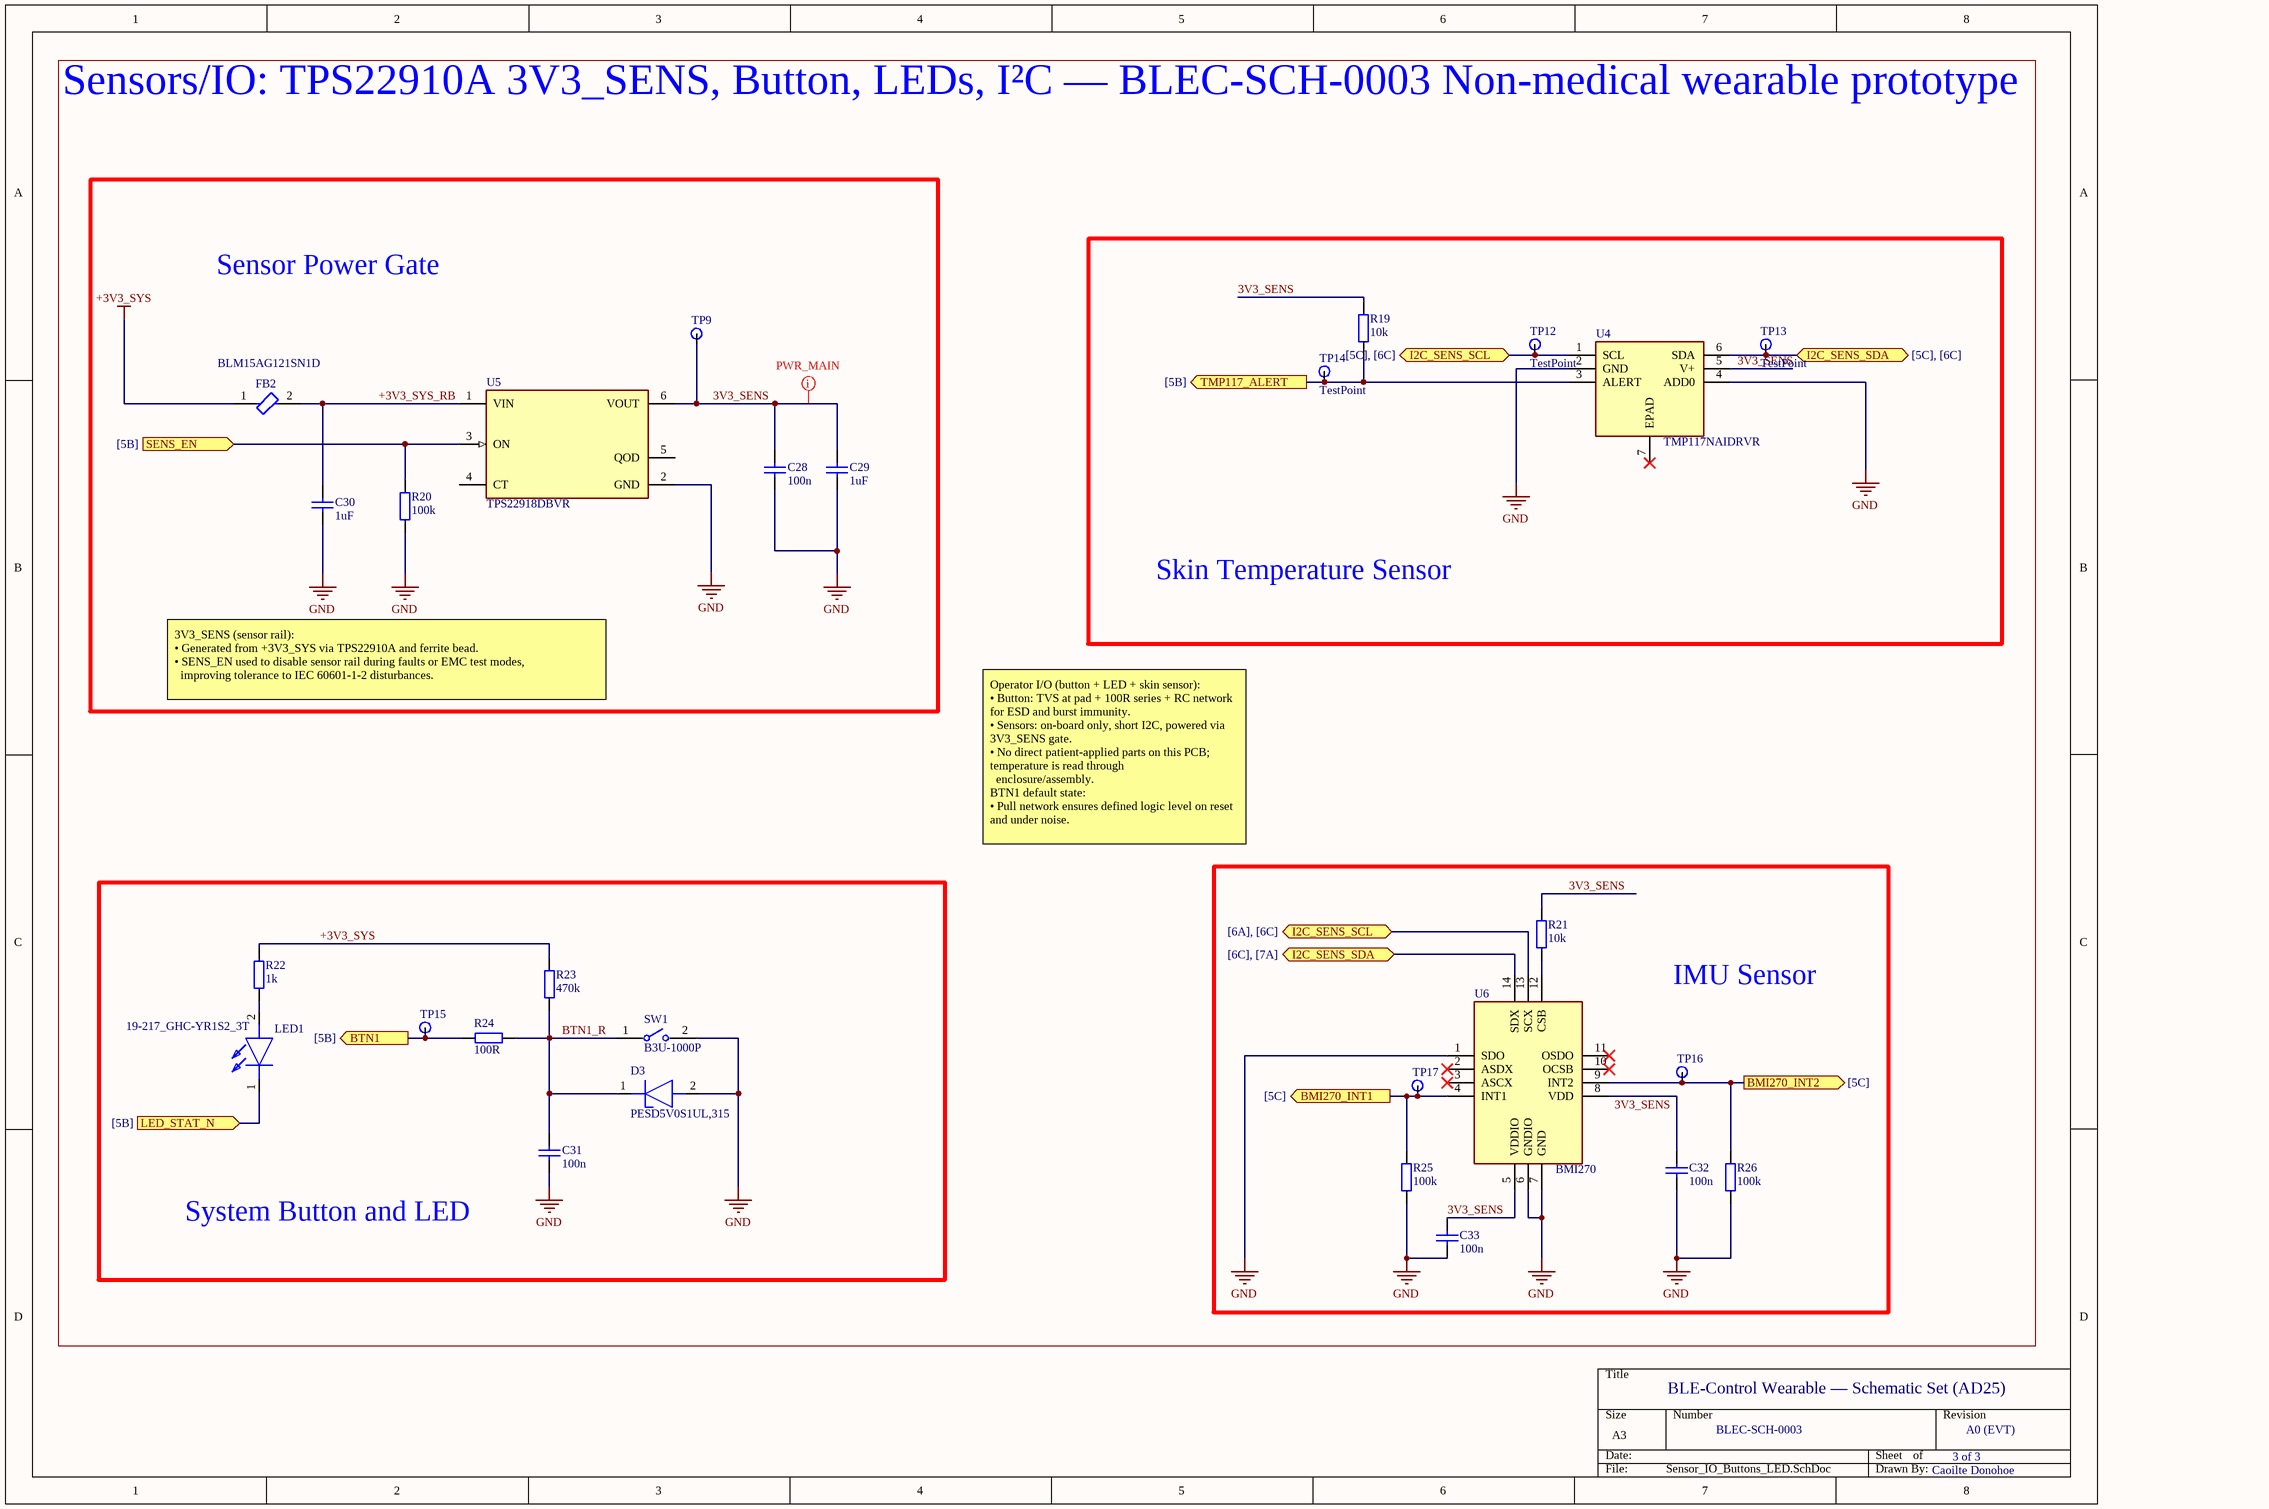
[diagram p2: Sensor_IO_Buttons_LED.SchDoc]

### Parts
C28  100n  [CAP_0402]
C29  1uF  [CAP_0402]
C30  1uF  [CAP_0402]
C31  100n  [CAP_0402]
C32  100n  [CAP_0402]
C33  100n  [CAP_0402]
D3  PESD5V0S1UL,315  [PESD5V0S1BL315]
FB2  BLM15AG121SN1D  [FP-BLM15-0_05-IPC_A]
LED1  19-217_GHC-YR1S2_3T  [LEDC1608X50N]
R19  10k  [RES_0402]
R20  100k  [RES_0402]
R21  10k  [RES_0402]
R22  1k  [RES_0402]
R23  470k  [RES_0402]
R24  100R  [RES_0402]
R25  100k  [RES_0402]
R26  100k  [RES_0402]
SW1  B3U-1000P  [FP-B3U-1000P-MFG]
TP9  (no value)  [TP_VIA_0p75]
TP12  TestPoint  [TP_VIA_0p75]
TP13  TestPoint  [TP_VIA_0p75]
TP14  TestPoint  [TP_VIA_0p75]
TP15  (no value)  [TP_VIA_0p75]
TP16  (no value)  [TP_VIA_0p75]
TP17  (no value)  [TP_VIA_0p75]
U4  TMP117NAIDRVR  [SON65P200X200X80-7N]
U5  TPS22918DBVR  [FP-DBV0006A-IPC_B]
U6  BMI270  [BMI270]

### Blocks framed on the sheet
Sensor Power Gate: C28-C30 FB2 R20 TP9 U5
Skin Temperature Sensor: R19 TP12-TP14 U4
System Button and LED: C31 D3 LED1 R22-R24 SW1 TP15
IMU Sensor: C32 C33 R21 R25 R26 TP16 TP17 U6

### Ports
BMI270_INT1 (out, see [5C]), BMI270_INT2 (out, see [5C]), BTN1 (out, see [5B]), I2C_SENS_SCL (bidir, see [5C], [6C]), I2C_SENS_SCL (bidir, see [6A], [6C]), I2C_SENS_SDA (bidir, see [5C], [6C]), I2C_SENS_SDA (bidir, see [6C], [7A]), LED_STAT_N (in, see [5B]), SENS_EN (in, see [5B]), TMP117_ALERT (out, see [5B])

### Nets
+3V3_SYS: FB2.1 R22.2 R23.2
GND: C28.1 C29.1 C30.1 C31.1 C32.1 C33.1 D3.2(A) R20.1 R25.1 R26.1 SW1.2 U4.2(GND) U4.4(ADD0) U5.2(GND) U6.1(SDO) U6.6(GNDIO) U6.7(GND)
3V3_SENS: C28.2 C29.2 C32.2 C33.2 R19.2 R21.2 TP9.1 U4.5(V+) U5.6(VOUT) U6.5(VDDIO) U6.8(VDD)
+3V3_SYS_RB: C30.2 FB2.2 U5.1(VIN)
BMI270_INT1: R25.2 TP17.1 U6.4(INT1) ; port BMI270_INT1
BMI270_INT2: R26.2 TP16.1 U6.9(INT2) ; port BMI270_INT2
BTN1: R24.2 TP15.1 ; port BTN1
BTN1_R: C31.2 D3.1(K) R23.1 R24.1 SW1.1
I2C_SENS_SCL: TP12.1 U4.1(SCL) U6.13(SCX) ; port I2C_SENS_SCL
I2C_SENS_SDA: TP13.1 U4.6(SDA) U6.14(SDX) ; port I2C_SENS_SDA
LED_STAT_N: LED1.1(K) ; port LED_STAT_N
SENS_EN: R20.2 U5.3(ON) ; port SENS_EN
TMP117_ALERT: R19.1 TP14.1 U4.3(ALERT) ; port TMP117_ALERT
NetLED1_2: LED1.2(A) R22.1
NetR21_1: R21.1 U6.12(CSB)

Not connected (* = marked no-connect by the designer): U4 7(EPAD)*; U5 4(CT) 5(QOD); U6 2(ASDX)* 3(ASCX)* 10(OCSB)* 11(OSDO)*

### Layout directives
net class PWR_MAIN: 3V3_SENS

### Notes on the sheet
- Sensors/IO: TPS22910A 3V3_SENS, Button, LEDs, I²C — BLEC-SCH-0003 Non-medical wearable prototype
- 3V3_SENS (sensor rail):
  • Generated from +3V3_SYS via TPS22910A and ferrite bead.
  • SENS_EN used to disable sensor rail during faults or EMC test modes,
  improving tolerance to IEC 60601-1-2 disturbances.
- Operator I/O (button + LED + skin sensor):
  • Button: TVS at pad + 100R series + RC network for ESD and burst immunity.
  • Sensors: on-board only, short I2C, powered via 3V3_SENS gate.
  • No direct patient-applied parts on this PCB; temperature is read through
  enclosure/assembly.                                       BTN1 default state:
  • Pull network ensures defined logic level on reset and under noise.
- BLE-Control Wearable — Schematic Set (AD25)
- BLEC-SCH-0003
- 3 of 3
- A0 (EVT)
- Caoilte Donohoe

### Library data of the parts
C28 C31-C33 = C_0402: as C1 on sheet Power_Charge_USB; Package: 0402 (1005); Height: 0.35mm
C29 C30 = C_0402: as C8 on sheet Power_Charge_USB; Package: 0402 (1005); Height: 0.35mm; Part Number: C1005X5R1E105K
D3 = PESD5V0S1UL,315: as ESD_CC1 on sheet Power_Charge_USB; Datasheet Link: https://assets.nexperia.com/documents/data-sheet/PESD5V0S1UL.pdf; Height: 0mm; Manufacturer_Part_Number: PESD5V0S1UL,315; Mouser Part Number: 771-PESD5V0S1UL315; Mouser Price/Stock: https://www.mouser.co.uk/ProductDetail/Nexperia/PESD5V0S1UL315?qs=LOCUfHb8d9sSC%2FUB7ugsVw%3D%3D; Arrow Part Number: PESD5V0S1UL,315; Arrow Price/Stock: https://www.arrow.com/en/products/pesd5v0s1ul315/nexperia?utm_currency=USD&region=nac
FB2 = CMP-0686-00170-4: as FB1 on sheet Power_Charge_USB; Packaging: Tape and Reel; Core Material: Ferrite; Number of Pins: 2; Tolerance: 25%; Case Code (Imperial): 0402; DC Current: 500mA; Termination: SMD/SMT; Height: 0.5mm; REACH SVHC: No SVHC; Max Operating Temperature: 125°C; Case Code (Metric): 1005; Length: 1mm; Test Frequency: 100MHz; Lead Free: Lead Free; Depth: 0.55mm; Max Current Rating: 550mA; Case/Package: 0402; Min Operating Temperature: -55°C; Width: 0.5mm; Military Standard: Not; Frequency: 100MHz; Current Rating: 550mA; Package Quantity: 1; Number of Circuits: 1; Radiation Hardening: No
LED1 = 19-217_GHC-YR1S2_3T: LED; Manufacturer_Name: Everlight; Manufacturer_Part_Number: 19-217/GHC-YR1S2/3T; Datasheet Link: https://www.mouser.co.uk/datasheet/2/143/19-217-GHC-YR1S2-3T-1663276.pdf; Height: 0.5mm; Mouser Part Number: 638-19217GHCYR1S23T; Mouser Price/Stock: https://www.mouser.co.uk/ProductDetail/Everlight/19-217-GHC-YR1S2-3T?qs=8cKuZ6Ok2lZjmFTUzVFjDg%3D%3D; Arrow Part Number: 19-217/GHC-YR1S2/3T; Arrow Price/Stock: https://www.arrow.com/en/products/19-217ghc-yr1s23t/everlight-electronics
R19-R26 = R_0402: Resistor SMD 0402; Manufacturer: *; Manufacturer Part Number: *; Distributor Link: *; LCSC: *
SW1 = Omron B3U-1000P_Switch: SWITCH TACTILE SPST-NO 0.05A 12V; Contact Resistance: 100mR; Operating Force: 1.5N; Max Current Rating: 50mA; Switch Travel: 0.15mm; Actuator Type: Standard; Mechanical Life: 200000Cycles; Ratings: Dust Proof; Illumination Type: Non-Illuminated; Throw Configuration: SPST; Actuator Length: 0.4mm; Switch Function: Off-Mom; Height: 1.2mm; Width: 3mm; Weight: 0.000776oz; Contact Material: Silver; Max Voltage Rating (DC): 12V; Insulation Resistance: 100MR; Lead Free: Lead Free; Current Rating: 50mA; Termination: SMD/SMT; Length: 4mm; Voltage Rating (DC): 12V; Contact Current Rating: 50mA; Orientation: Straight; Depth: 2.5mm; Max Operating Temperature: 70°C; Packaging: Tape and Reel; Min Operating Temperature: -25°C; Package Quantity: 1; Mount: Surface Mount; Electrical Life: 200000Cycles
TP9 TP15-TP17 = TestPoint
U4 = TMP117NAIDRVR: Integrated Circuit; Manufacturer_Name: Texas Instruments; Datasheet Link: http://www.ti.com/lit/gpn/tmp117; Height: 0.8mm; Manufacturer_Part_Number: TMP117NAIDRVR; Mouser Part Number: 595-TMP117NAIDRVR; Mouser Price/Stock: https://www.mouser.co.uk/ProductDetail/Texas-Instruments/TMP117NAIDRVR?qs=qSfuJ%252Bfl%2Fd51FgClPJTgfg%3D%3D; Arrow Part Number: TMP117NAIDRVR; Arrow Price/Stock: https://www.arrow.com/en/products/tmp117naidrvr/texas-instruments?utm_currency=USD&region=nac
U5 = TPS22918DBVR: IC SINGLE CHANNEL LOAD SWITCH; NexarPartId: 71360943; Manufacturer Lifecycle Status: ACTIVE; Fall Time: 2µs; Max Junction Temperature (Tj): 125°C; Number of Channels: 1; Output Current: 2A; Max Supply Voltage: 5.5V; Output Configuration: High Side; Min Supply Voltage: 1V; Interface: On/Off; Rise Time: 2.54ms; Turn-On Delay Time: 1.95ms; Lead Free: Lead Free; RoHS: Compliant; Ambient Temperature Range High: 105°C; Thickness: 1.2mm; Width: 1.6mm; Lifecycle Status: Production; Case/Package: SOT-23; Schedule B: 8542390000, 8542390000|8542390000|8542390000|8542390000|8542390000|8542390000|8542390000|8542390000|8542390000|8542390000|8542390000|8542390000|8542390000|8542390000|8542390000|8542390000|8542390000|8542390000|8542390000|8542390000|8542390000|8542390000|8542390000|85; Turn-Off Delay Time: 2µs; Max Output Current: 2A; Number of Outputs: 1; Number of Pins: 6; Height: 1.45mm; Number of Drivers: 1; Length: 2.9mm; Max Operating Temperature: 105°C; Min Operating Temperature: -40°C
U6 = BMI270: Integrated Circuit; Manufacturer_Name: BOSCH; Datasheet Link: https://www.bosch-sensortec.com/media/boschsensortec/downloads/datasheets/bst-bmi270-ds000.pdf; Height: 0.87mm; Manufacturer_Part_Number: BMI270; Mouser Part Number: 262-BMI270; Mouser Price/Stock: https://www.mouser.co.uk/ProductDetail/Bosch-Sensortec/BMI270?qs=u16ybLDytRYIj%252BjQEee88A%3D%3D; Arrow Part Number: BMI270; Arrow Price/Stock: https://www.arrow.com/en/products/bmi270/bosch-sensortec?utm_currency=USD&region=nac

## Nets that join several sheets
+3V3_SYS: Power_Charge_USB (C1.2 C2.2 U2.5), MCU_RF (18 pins), Sensor_IO_Buttons_LED (FB2.1 R22.2 R23.2)
GND: Power_Charge_USB (23 pins), MCU_RF (29 pins), Sensor_IO_Buttons_LED (17 pins)
BMI270_INT1: MCU_RF (U3.42), Sensor_IO_Buttons_LED (R25.2 TP17.1 U6.4)
BMI270_INT2: MCU_RF (U3.45), Sensor_IO_Buttons_LED (R26.2 TP16.1 U6.9)
BTN1: MCU_RF (U3.14), Sensor_IO_Buttons_LED (R24.2 TP15.1)
I2C_SENS_SCL: MCU_RF (R14.2), Sensor_IO_Buttons_LED (TP12.1 U4.1 U6.13)
I2C_SENS_SDA: MCU_RF (R15.2), Sensor_IO_Buttons_LED (TP13.1 U4.6 U6.14)
LED_STAT_N: MCU_RF (U3.13), Sensor_IO_Buttons_LED (LED1.1)
SENS_EN: MCU_RF (U3.17), Sensor_IO_Buttons_LED (R20.2 U5.3)
TMP117_ALERT: MCU_RF (U3.11), Sensor_IO_Buttons_LED (R19.1 TP14.1 U4.3)
USB_FS_R_N: Power_Charge_USB (FL1.3), MCU_RF (R10.2)
USB_FS_R_P: Power_Charge_USB (FL1.4), MCU_RF (R12.2)